# Altium project Battery_Monitoring.PrjPcb
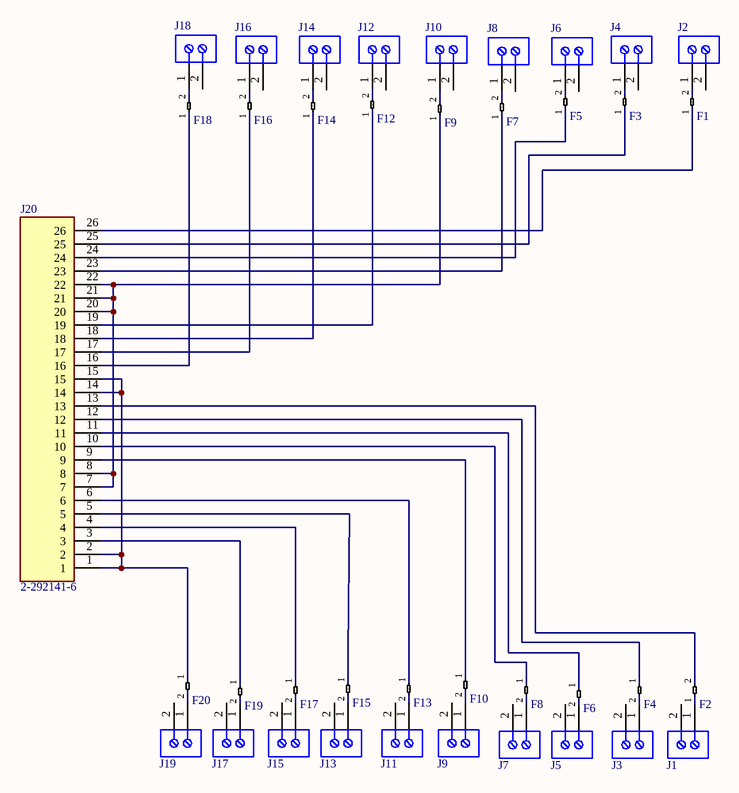
[diagram p0: VoltTap.SchDoc]
1 sheet, 39 parts. Net scope: global (net labels, ports and power ports of the same name join across sheets).
Board file: VoltTap.PcbDoc

## Sheet VoltTap.SchDoc: Voltage Tap Fusing & Splitter
size A; DrawnBy: Matthew McCauley; Address4: 2.2.1; Revision: 1; SheetNumber: 1; SheetTotal: 1

### Parts
F1  C1T5  [C1T5]  (value not drawn)
F2  C1T5  [C1T5]  (value not drawn)
F3  C1T5  [C1T5]  (value not drawn)
F4  C1T5  [C1T5]  (value not drawn)
F5  C1T5  [C1T5]  (value not drawn)
F6  C1T5  [C1T5]  (value not drawn)
F7  C1T5  [C1T5]  (value not drawn)
F8  C1T5  [C1T5]  (value not drawn)
F9  C1T5  [C1T5]  (value not drawn)
F10  C1T5  [C1T5]  (value not drawn)
F12  C1T5  [C1T5]  (value not drawn)
F13  C1T5  [C1T5]  (value not drawn)
F14  C1T5  [C1T5]  (value not drawn)
F15  C1T5  [C1T5]  (value not drawn)
F16  C1T5  [C1T5]  (value not drawn)
F17  C1T5  [C1T5]  (value not drawn)
F18  C1T5  [C1T5]  (value not drawn)
F19  C1T5  [C1T5]  (value not drawn)
F20  C1T5  [C1T5]  (value not drawn)
J1  691102710002  [691102710002]  (value not drawn)
J2  691102710002  [691102710002]  (value not drawn)
J3  691102710002  [691102710002]  (value not drawn)
J4  691102710002  [691102710002]  (value not drawn)
J5  691102710002  [691102710002]  (value not drawn)
J6  691102710002  [691102710002]  (value not drawn)
J7  691102710002  [691102710002]  (value not drawn)
J8  691102710002  [691102710002]  (value not drawn)
J9  691102710002  [691102710002]  (value not drawn)
J10  691102710002  [691102710002]  (value not drawn)
J11  691102710002  [691102710002]  (value not drawn)
J12  691102710002  [691102710002]  (value not drawn)
J13  691102710002  [691102710002]  (value not drawn)
J14  691102710002  [691102710002]  (value not drawn)
J15  691102710002  [691102710002]  (value not drawn)
J16  691102710002  [691102710002]  (value not drawn)
J17  691102710002  [691102710002]  (value not drawn)
J18  691102710002  [691102710002]  (value not drawn)
J19  691102710002  [691102710002]  (value not drawn)
J20  2-292141-6  [TE_2-292141-6]

### Nets
NetF1_1: F1.1 J20.26
NetF1_2: F1.2 J2.1
NetF2_1: F2.1 J1.1
NetF2_2: F2.2 J20.13
NetF3_1: F3.1 J20.25
NetF3_2: F3.2 J4.1
NetF4_1: F4.1 J20.12
NetF4_2: F4.2 J3.1
NetF5_1: F5.1 J20.24
NetF5_2: F5.2 J6.1
NetF6_1: F6.1 J20.11
NetF6_2: F6.2 J5.1
NetF7_1: F7.1 J20.23
NetF7_2: F7.2 J8.1
NetF8_1: F8.1 J20.10
NetF8_2: F8.2 J7.1
NetF9_1: F9.1 J20.7 J20.8 J20.20 J20.21 J20.22
NetF9_2: F9.2 J10.1
NetF10_1: F10.1 J20.9
NetF10_2: F10.2 J9.1
NetF12_1: F12.1 J20.19
NetF12_2: F12.2 J12.1
NetF13_1: F13.1 J20.6
NetF13_2: F13.2 J11.1
NetF14_1: F14.1 J20.18
NetF14_2: F14.2 J14.1
NetF15_1: F15.1 J20.5
NetF15_2: F15.2 J13.1
NetF16_1: F16.1 J20.17
NetF16_2: F16.2 J16.1
NetF17_1: F17.1 J20.4
NetF17_2: F17.2 J15.1
NetF18_1: F18.1 J20.16
NetF18_2: F18.2 J18.1
NetF19_1: F19.1 J20.3
NetF19_2: F19.2 J17.1
NetF20_1: F20.1 J20.1 J20.2 J20.14 J20.15
NetF20_2: F20.2 J19.1

Not connected (* = marked no-connect by the designer): J1 2; J2 2; J3 2; J4 2; J5 2; J6 2; J7 2; J8 2; J9 2; J10 2; J11 2; J12 2; J13 2; J14 2; J15 2; J16 2; J17 2; J18 2; J19 2

### Notes on the sheet
- Title
- Size:
- Date:
- A
- WBS:
- Time:
- Revision:
- Sheet
- of
- Drawn By:
- File:

### Library data of the parts
J1-J19 = CMP-1502-03258-1: Series 102 - 5.00 mm Horizontal Entry Modular with Pressure Clamp WR-TBL, 2 pin; Manufacturer: Wurth Elektronik; Pin Number: 2; Pitch: 5.00mm; Manufacturer URL: http://www.we-online.de; Mounting Technology: THT; Publisher: WurthElektronik; Packaging: Box; Package Reference: 691102710002; Datasheet URL: http://katalog.we-online.de/em/datasheet/6911027100xx.pdf; Operating Temperature: -40to105degC; Part Number: 691102710002
J20 = 2-292141-6: MF: {'manufacturer': 'TE Connectivity'}; Availability: Unavailable; MP: 2-292141-6; Package: None; Value: *; Price: None
F1-F10 F12-F20 = C1T5: ComponentLink1Description: New link; ComponentLink1URL: https://www.mouser.com/ProductDetail/Bel-Fuse/C1T5?qs=GtFly9OVs8%2FF1GxRAaUoTA%3D%3D#.Xzf8gWXWqWc.link